# EasyEDA Pro project ProPrj_HydromatMK1_2025-12-27_13-47-41_2026-04-05.epro, board PCB_HydromatMK1
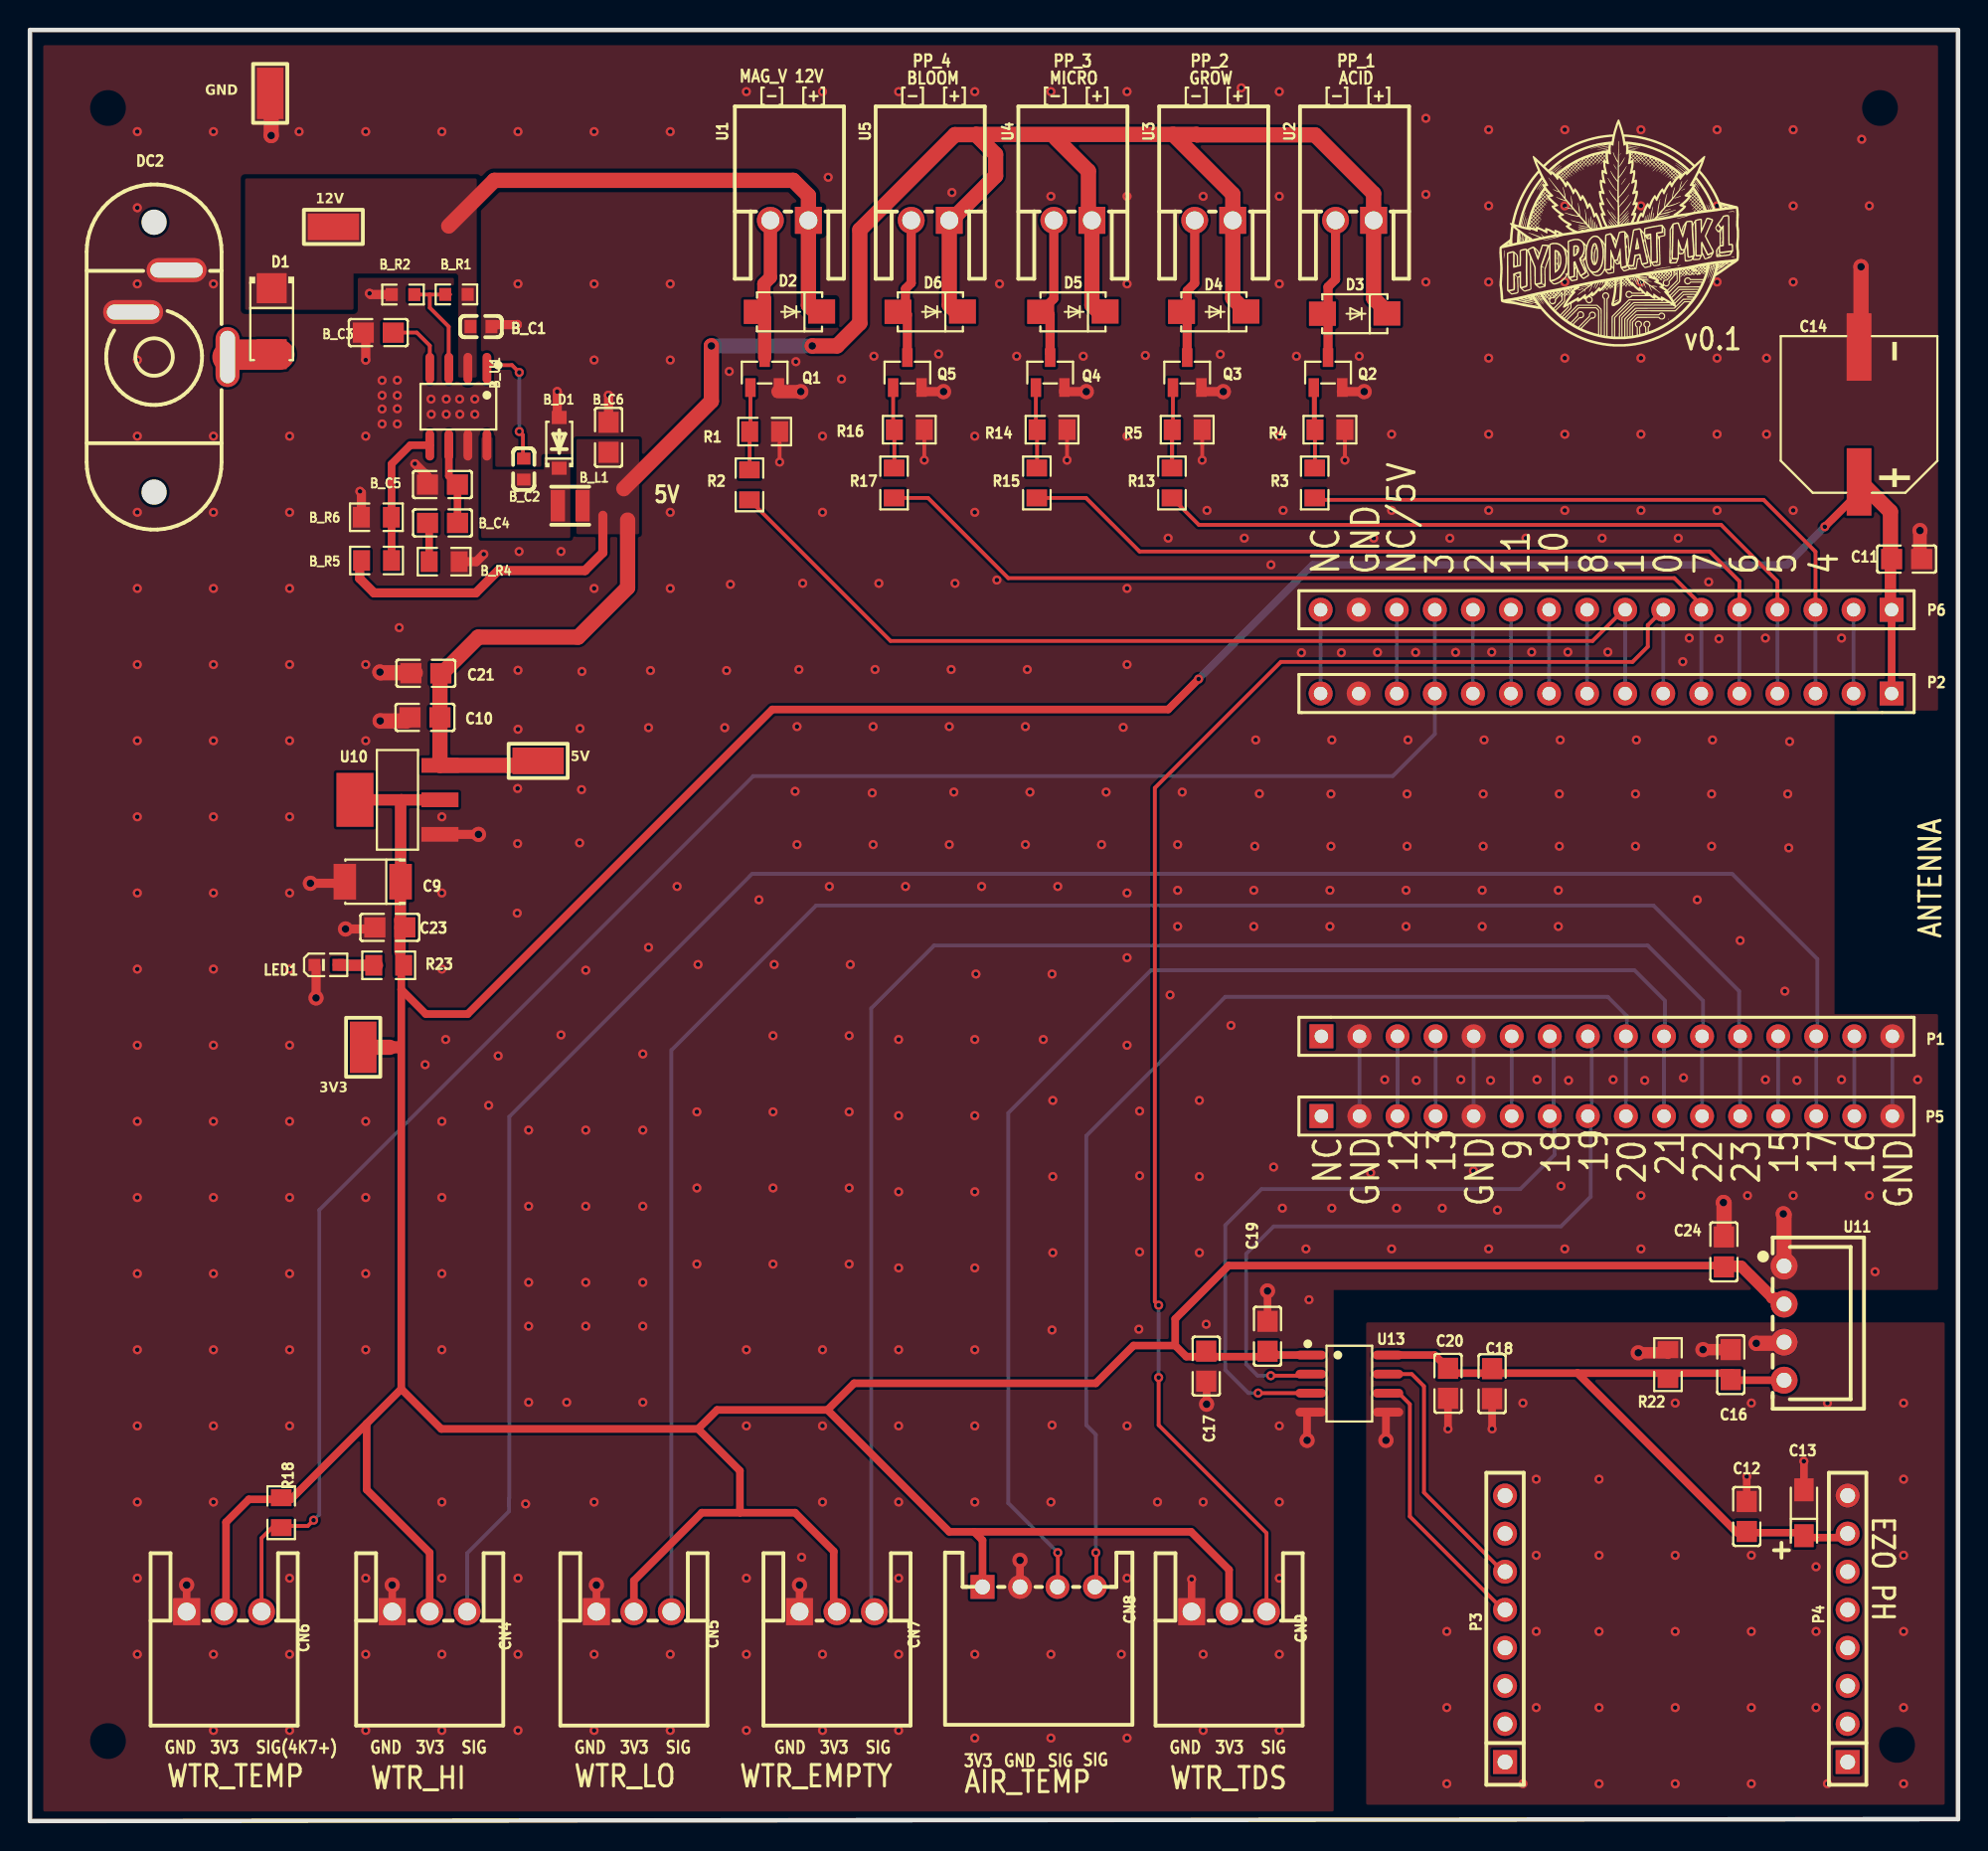
[diagram p1: board, top side]
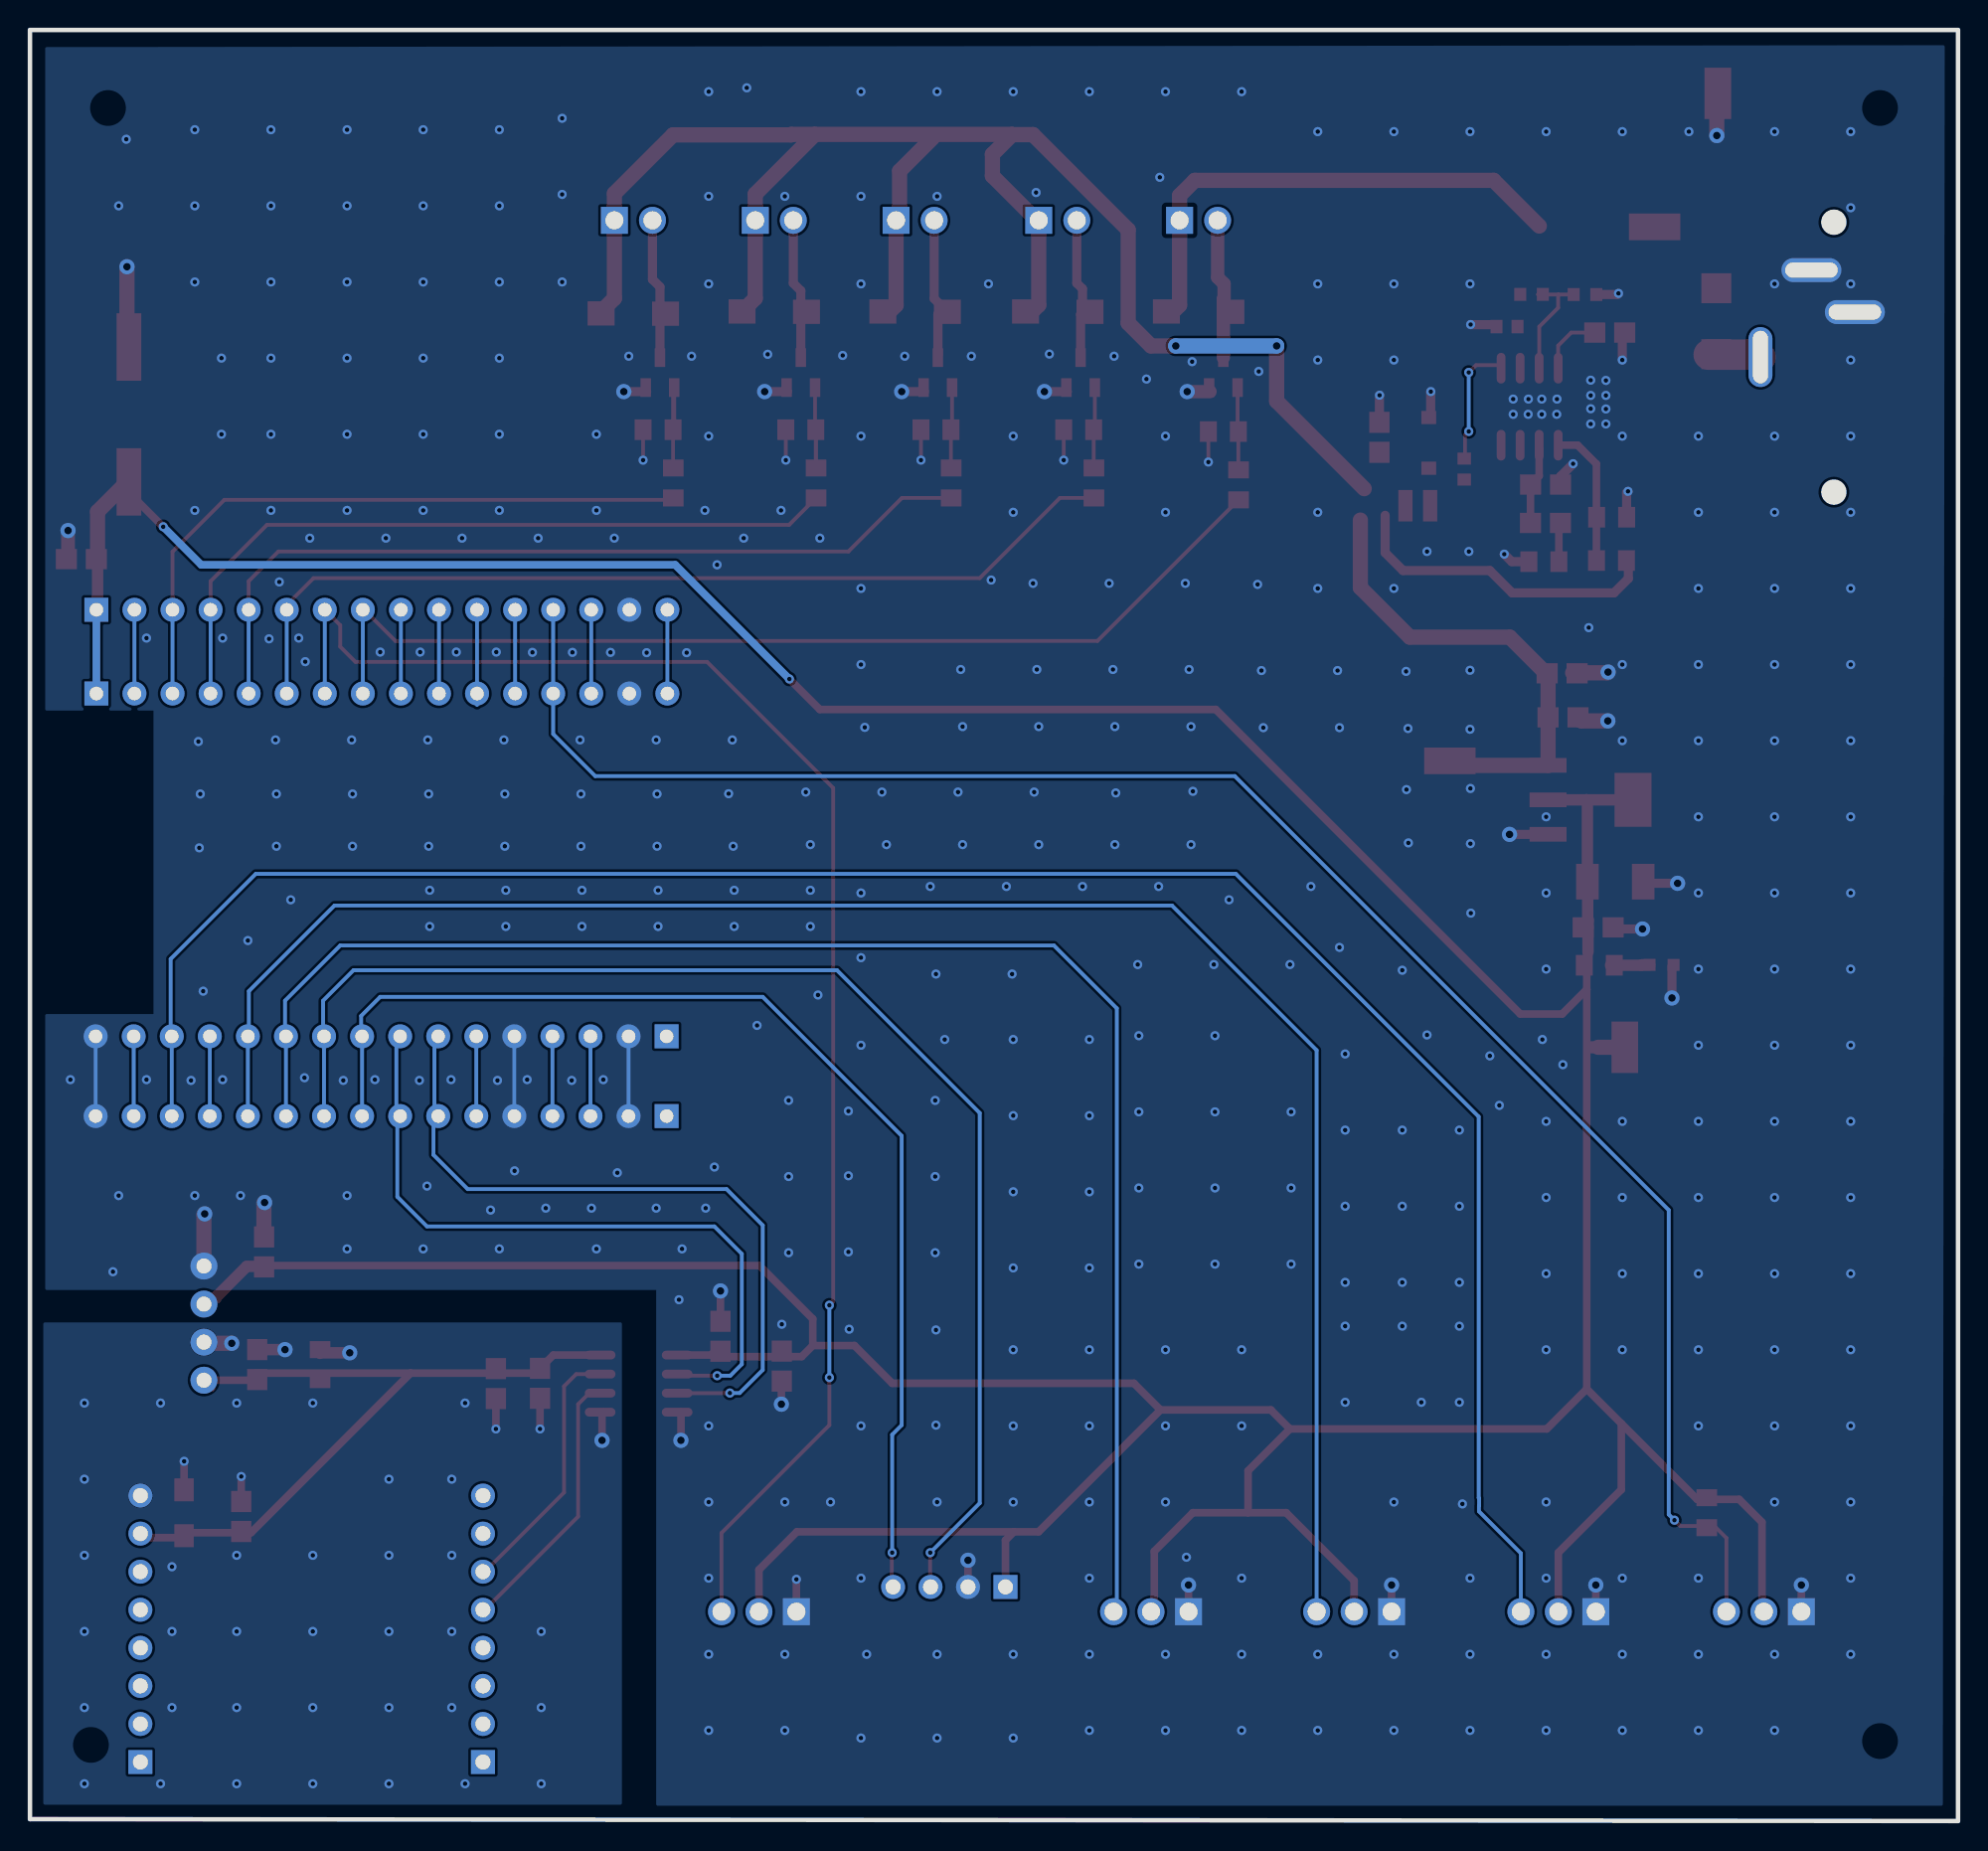
[diagram p2: board, bottom side, seen from below]

Outline 128.65 x 119.51 mm; copper layers: Top Layer, Bottom Layer. Coordinates in mm from the lower left corner of the outline.
Outline path: 0,119.51 0,0 128.65,0.13 128.65,119.51 0,119.51
Stack: Top Layer 0.035mm / Dielectric1 1.51mm FR4 er 4.5 / Bottom Layer 0.035mm

## Design rules (mm)
template: User Custom Config
spacing Default (default): track to track 0.2, other pairs 0 to 0.4
spacing 12V: track to track 0.281, other pairs 0 to 0.281
spacing GND: track to track 0.152, other pairs 0 to 0.175
track width Default (default): min 0.254, default 0.254, max 25.4
track width 12V: min 0.762, default 0.889, max 1.016
track width GND: min 0.254, default 0.254, max 25.4
track width 5V: min 0.127, default 0.61, max 2.54
track width 3V3: min 0.127, default 0.508, max 2.54
differential pair differentialPair (default): width min 0.127, default 0.254, max 2.54; gap min 0.152, default 0.152
via Default (default): diameter min 0.61, default 0.61, max 100.025; hole min 0.305, default 0.305, max 59.995
via 12V: diameter min 1.2, default 1.2, max 100.025; hole min 0.6, default 0.6, max 59.995
via GND: diameter min 0.61, default 0.61, max 100.025; hole min 0.305, default 0.305, max 59.995
net 12V uses 12V
net GND uses GND
net 3V3 uses 3V3
net 5V uses 5V
net 3V3_ISO uses 3V3
net GND_ISO uses GND

## Placement (name value [footprint] x y rotation side)
3V3  5017  [TEST-SMD_L2.7-W1.0]  22.23 51.63 270 top
5V  5017  [TEST-SMD_L2.7-W1.0]  33.91 70.74 0 top
12V  5017  [TEST-SMD_L2.7-W1.0]  20.25 106.37 0 top
B_C1  10uF  [C0603]  30.09 99.72 180 top
B_C2  100nF  [C0603]  32.95 90.21 90 top
B_C3  8.2nF  [C0805]  23.24 99.31 0 top
B_C4  1nF  [C0805]  27.53 86.61 0 top
B_C5  24pF  [C0805]  27.52 89.18 0 top
B_C6  10uF  [C0805]  38.61 92.33 270 top
B_D1  SS24FL  [SOD-123_L2.6-W1.6-LS3.5-RD]  35.32 91.96 90 top
B_L1  6.8uH  [IND-SMD_L2.5-W2.0_FTC252010S]  36.05 87.76 0 top
B_R1  169kΩ  [R0603]  28.46 101.86 0 top
B_R2  39.2kΩ  [R0603]  24.89 101.85 0 top
B_R4  45.3kΩ  [R0805]  27.64 84.03 180 top
B_R5  10.2kΩ  [R0805]  23.12 84.11 180 top
B_R6  10kΩ  [R0805]  23.11 87 0 top
B_U1  TPS54232DR  [SOIC-8_L4.9-W3.9-P1.27-LS6.0-BL]  28.58 94.37 180 top
C9  22uF  [CASE-B_3528]  22.87 62.68 180 top
C10  10uF  [C0805]  26.36 73.64 0 top
C11  100nF  [C0805]  125.22 84.2 180 top
C12  100nF  [C0805]  114.55 20.32 270 top
C13  10uF  [CAP-SMD_L3.2-W1.6-RD-C7171]  118.37 20.57 90 top
C14  470uF  [CAP-SMD_BD10.0-L10.3-W10.3-LS11.0-FD]  122.05 93.85 90 top
C16  10uF  [C0805]  113.49 30.45 270 top
C17  100nF  [C0805]  78.49 30.35 90 top
C18  100nF  [C0805]  97.56 29.19 90 top
C19  10uF  [C0805]  82.58 32.34 270 top
C20  10uF  [C0805]  94.62 29.21 90 top
C21  100nF  [C0805]  26.42 76.58 0 top
C23  100nF  [C0805]  24.01 59.63 0 top
C24  10uF  [C0805]  113.03 37.97 90 top
CN4  S3B-XH-A-1(LF)(SN)  [CONN-TH_S3B-XH-A-1-LF-SN]  26.67 13.97 180 top
CN5  S3B-XH-A-1(LF)(SN)  [CONN-TH_S3B-XH-A-1-LF-SN]  40.3 13.97 180 top
CN6  S3B-XH-A-1(LF)(SN)  [CONN-TH_S3B-XH-A-1-LF-SN]  12.95 13.97 180 top
CN7  S3B-XH-A-1(LF)(SN)  [CONN-TH_S3B-XH-A-1-LF-SN]  53.85 13.97 180 top
CN8  S4B-XH-A(LF)(SN)  [CONN-TH_S4B-XH-A-LF-SN]  67.31 15.62 180 top
CN9  S3B-XH-A-1(LF)(SN)  [CONN-TH_S3B-XH-A-1-LF-SN]  80.01 13.97 180 top
D1  SS54  [SMA_L4.3-W2.6-LS5.1-RD]  16.13 100.08 270 top
D2  SS24  [SMA_L4.3-W2.6-LS5.0-FD]  50.67 100.71 0 top
D3  SS24  [SMA_L4.3-W2.6-LS5.0-FD]  88.39 100.58 0 top
D4  SS24  [SMA_L4.3-W2.6-LS5.0-FD]  78.99 100.71 0 top
D5  SS24  [SMA_L4.3-W2.6-LS5.0-FD]  69.59 100.71 0 top
D6  SS24  [SMA_L4.3-W2.6-LS5.0-FD]  60.07 100.71 0 top
DC2  DC-018-2.5A-2.5  [DC-IN-TH_DC-018]  10.03 100.58 180 top
GND  5017  [TEST-SMD_L2.7-W1.0]  16.03 115.28 270 top
LED1  XL-1608UGC-04  [LED0603-RD_GREEN]  19.78 57.12 0 top
P1  ZX-PM2.54-1-16PY  [HDR-TH_16P-P2.54-V-F-1]  105.22 52.36 0 top
P2  ZX-PM2.54-1-16PY  [HDR-TH_16P-P2.54-V-F-1]  105.17 75.23 180 top
P3  2.54-1*8P母环保  [HDR-TH_8P-P2.54-V-F_2]  98.43 12.83 90 top
P4  2.54-1*8P母环保  [HDR-TH_8P-P2.54-V-F_2]  121.28 12.83 90 top
P5  ZX-PM2.54-1-16PY  [HDR-TH_16P-P2.54-V-F-1]  105.22 47.04 0 top
P6  ZX-PM2.54-1-16PY  [HDR-TH_16P-P2.54-V-F-1]  105.17 80.82 180 top
Q1  IRLML6244TRPBF  [SOT-23-3_L2.9-W1.3-P1.90-LS2.4-BR]  49.02 96.65 270 top
Q2  IRLML6244TRPBF  [SOT-23-3_L2.9-W1.3-P1.90-LS2.4-BR]  86.61 96.65 270 top
Q3  IRLML6244TRPBF  [SOT-23-3_L2.9-W1.3-P1.90-LS2.4-BR]  77.22 96.65 270 top
Q4  IRLML6244TRPBF  [SOT-23-3_L2.9-W1.3-P1.90-LS2.4-BR]  68.07 96.65 270 top
Q5  IRLML6244TRPBF  [SOT-23-3_L2.9-W1.3-P1.90-LS2.4-BR]  58.55 96.65 270 top
R1  10kΩ  [R0805]  49.02 92.71 180 top
R2  100Ω  [R0805]  48.01 89.15 90 top
R3  100Ω  [R0805]  85.72 89.28 270 top
R4  10kΩ  [R0805]  86.74 92.84 180 top
R5  10kΩ  [R0805]  77.22 92.84 180 top
R13  100Ω  [R0805]  76.2 89.28 270 top
R14  10kΩ  [R0805]  68.2 92.84 180 top
R15  100Ω  [R0805]  67.18 89.28 270 top
R16  10kΩ  [R0805]  58.67 92.84 180 top
R17  100Ω  [R0805]  57.66 89.28 90 top
R18  4.7kΩ  [R0805]  16.76 20.57 270 top
R22  100Ω  [R0805]  109.3 30.45 270 top
R23  1kΩ  [R0805]  23.94 57.1 0 top
U1  S2B-XH-A-1(LF)(SN)  [CONN-TH_S2B-XH-A-1-LF-SN]  50.67 106.81 0 top
U2  S2B-XH-A-1(LF)(SN)  [CONN-TH_S2B-XH-A-1-LF-SN]  88.38 106.81 0 top
U3  S2B-XH-A-1(LF)(SN)  [CONN-TH_S2B-XH-A-1-LF-SN]  78.99 106.81 0 top
U4  S2B-XH-A-1(LF)(SN)  [CONN-TH_S2B-XH-A-1-LF-SN]  69.59 106.81 0 top
U5  S2B-XH-A-1(LF)(SN)  [CONN-TH_S2B-XH-A-1-LF-SN]  60.07 106.81 0 top
U10  AMS1117-3.3  [SOT-223-4_L6.5-W3.5-P2.30-LS7.0-BR]  24.52 68.14 0 top
U11  220kHz  [PWRM-TH_B0303S-1WR3]  117.04 33.22 270 top
U13  ADUM1201ARZ-RL7  [SOIC-8_L4.9-W3.9-P1.27-LS6.0-BL]  88.04 29.19 270 top

## Footprints (pads in the part's own frame, mm; a bottom-side part is the same pattern mirrored in y, then rotated)
C0603
  rect 0.8x0.9 smd: 1(-0.7,0) 2(0.7,0)
C0805
  rect 1.41x1.35 smd: 1(-1,0) 2(1,0)
CAP-SMD_BD10.0-L10.3-W10.3-LS11.0-FD
  rect 4.5x1.65 smd: 1(-4.5,0) 2(4.5,0)
CAP-SMD_L3.2-W1.6-RD-C7171
  rect 1.53x1.296 smd: 1(-1.53,0) 2(1.53,0)
CASE-B_3528
  rect 1.506x2.376 smd: 1(-1.861,0) 2(1.861,0)
CONN-TH_S2B-XH-A-1-LF-SN
  rect 1.8x1.8 hole 1.2: 1(1.27,0)
  round 1.8 hole 1.2: 2(-1.27,0)
CONN-TH_S3B-XH-A-1-LF-SN
  rect 1.8x1.8 hole 1.2: 1(2.5,0)
  round 1.8 hole 1.2: 2(0,0) 3(-2.5,0)
CONN-TH_S4B-XH-A-LF-SN
  rect 1.6x1.6 hole 1: 1(3.75,0)
  round 1.6 hole 1: 2(1.25,0) 3(-1.25,0) 4(-3.75,0)
DC-IN-TH_DC-018
  oval 1.6x4 hole 1x3.5: 1(-3.15,2.9)
  oval 4x1.6 hole 3.5x1: 2(0.25,-2.9) 3(3.15,-0.1)
HDR-TH_8P-P2.54-V-F_2
  rect 1.6x1.6 hole 1: 1(-8.89,0)
  round 1.6 hole 1: 2(-6.35,0) 3(-3.81,0) 4(-1.27,0) 5(1.27,0) 6(3.81,0) 7(6.35,0) 8(8.89,0)
HDR-TH_16P-P2.54-V-F-1
  rect 1.6x1.6 hole 0.9: 1(-19.05,0)
  round 1.6 hole 0.9: 2(-16.51,0) 3(-13.97,0) 4(-11.43,0) 5(-8.89,0) 6(-6.35,0) 7(-3.81,0) 8(-1.27,0) 9(1.27,0) 10(3.81,0) 11(6.35,0) 12(8.89,0) 13(11.43,0) 14(13.97,0) 15(16.51,0) 16(19.05,0)
IND-SMD_L2.5-W2.0_FTC252010S
  rect 0.95x2.1 smd: 1(-0.825,0) 2(0.825,0)
LED0603-RD_GREEN
  rect 0.8x0.8 smd: 1(-0.799,-0.004) 2(0.799,0.004)
PWRM-TH_B0303S-1WR3
  round 1.8 hole 1: 1(-3.81,0) 2(-1.27,0) 3(1.27,0) 4(3.81,0)
R0603
  rect 0.806x0.864 smd: 1(-0.753,0) 2(0.753,0)
R0805
  rect 1.133x1.377 smd: 1(-1,0) 2(1,0)
SMA_L4.3-W2.6-LS5.0-FD
  rect 1.8x1.62 smd: 1(2.15,0.009) 2(-2.15,-0.009)
SMA_L4.3-W2.6-LS5.1-RD
  rect 2x2 smd: 1(-2.2,0) 2(2.2,0)
SOD-123_L2.6-W1.6-LS3.5-RD
  rect 0.88x0.99 smd: 1(-1.692,0) 2(1.692,0)
SOIC-8_L4.9-W3.9-P1.27-LS6.0-BL
  oval 0.588x2.045 smd: 1(-1.905,-2.57) 2(-0.635,-2.57) 3(0.635,-2.57) 4(1.905,-2.57) 5(1.905,2.57) 6(0.635,2.57) 7(-0.635,2.57) 8(-1.905,2.57)
SOT-23-3_L2.9-W1.3-P1.90-LS2.4-BR
  rect 1.25x0.7 smd: 1(1,-0.95) 2(1,0.95) 3(-1,0)
SOT-223-4_L6.5-W3.5-P2.30-LS7.0-BR
  rect 2.47x0.98 smd: 1(2.835,-2.3) 2(2.835,0) 3(2.835,2.3)
  rect 2.47x3.6 smd: 4(-2.835,0)
TEST-SMD_L2.7-W1.0
  rect 3.43x1.78 smd: 1(0,0)

## Nets
As in the schematic.

Pads without a net: P1 1; P2 14 16; P3 1 2 3 4 7 8; P4 1 2 3 4 5 6; P5 1; P6 14 16

## Via types
v1: diameter 0.61, hole 0.305, Top Layer to Bottom Layer, 503 vias
v2: diameter 1.016, hole 0.508, Top Layer to Bottom Layer, 30 vias

## Routing (per net, layer and track width the routed paths; a pad name or vN(x,y) marks a point on that pad's centre or on a via; arc(x,y) is an arc through that point)
3V3: length 393
  Top Layer w0.475: 24.77,57.39 24.69,57.48
  Top Layer w0.508: v1(119.76,86.36) 122.05,88.65 122.05,89.46 ; 47.37,20.57 47.37,23.37 44.58,26.16 ; 47.37,20.57 51.05,20.57 53.63,18 53.63,13.97 ; 47.37,20.57 44.83,20.57 40.3,16.04 CN5.2 ; 24.77,28.83 27.44,26.16 44.58,26.16 ; 24.77,28.83 24.77,55.49 ; 24.77,28.83 22.47,26.52 ; 22.47,26.52 22.47,22.11 26.67,17.91 CN4.2 ; 22.47,26.52 17.41,21.46 14.61,21.46 13.08,19.94 13.08,14.1 CN6.2 ; 44.58,26.16 45.85,27.43 53.21,27.43 ; 76.42,31.73 73.64,31.73 71.12,29.21 54.99,29.21 53.21,27.43 ; 76.42,31.73 77.16,30.99 82.6,30.99 82.96,31.34 83.21,31.09 85.21,31.09 ; 76.42,31.73 76.42,33.5 79.97,37.06 112.99,37.06 113.04,37.01 ; 53.21,27.43 61.35,19.3 63,19.3 ; v1(77.98,76.2) 75.95,74.17 49.53,74.17 29.21,53.85 26.41,53.85 24.77,55.49 ; 24.77,55.49 24.77,57.9 24.69,57.99 24.69,57.48 ; 24.71,62.66 C9.1 ; 24.69,59.61 24.71,59.63 ; 63,19.3 77.47,19.3 80.01,16.76 CN9.2 ; 63,19.3 63.56,18.74 63.56,15.78 ; 124.22,75.61 124.22,80.69
  Top Layer w0.762: 116.51,34.9 116.92,34.49 U11.2 ; 124.14,84.2 124.14,81.03 124.22,80.95 ; 24.69,57.99 24.69,60.11 24.71,60.14 24.71,62.91 24.73,62.93 24.73,68.08 24.78,68.14 ; 116.23,34.9 116.23,34.96 114.18,37.01 113.04,37.01 ; 24.78,68.14 U10.2 ; 24.78,68.14 U10.4
  Top Layer w0.813: 24,51.63 24.51,51.63
  Top Layer w1.016: 3V3.1 24,51.63 ; 122.05,89.46 124.14,87.36 124.14,84.2
  Bottom Layer w0.508: v1(119.76,86.36) 117.22,83.82 85.6,83.82 v1(77.98,76.2) ; P2.1 P6.1
3V3_ISO: length 50.8
  Top Layer w0.508: 90.35,31.09 93.73,31.09 C20.2 94.94,29.89 103.25,29.89 ; 103.25,29.89 113.9,19.24 118.04,19.24 118.37,18.91 121.02,18.91 P4.7 ; 103.25,29.89 103.25,29.89 ; 103.25,29.89 113.56,29.89 114.04,29.41 U11.4 116.54,28.91
5V: length 169.7
  Top Layer w0.61: 22,84.11 22,82.91 22.95,81.95 29.75,81.95 31.24,83.44 37.03,83.44 38.23,84.63 38.23,87.12
  Top Layer w1.016: v2(52.2,98.42) 53.85,98.42 55.37,99.95 55.37,106.17 61.72,112.52 63.12,112.52 ; 34.04,70.99 33.48,70.44 U10.3 C10.2 27.36,76.44 29.91,78.99 36.58,78.99 39.88,82.3 39.88,86.8 ; D4.1 80.26,101.6 80.26,108.55 76.27,112.54 ; 63.12,112.52 63.14,112.54 76.27,112.54 ; 63.12,112.52 64.43,111.21 64.43,109.77 61.34,106.68 61.34,101.15 61.77,100.72 ; v2(45.47,98.42) 45.47,94.74 39.62,88.9 ; 76.27,112.54 77.84,112.54 77.88,112.51 85.74,112.51 89.65,108.59 89.65,101.6 90.53,100.72 ; 68.43,112.29 70.62,110.1 70.62,106.92 70.86,106.69 70.86,101.14 71.29,100.71
  Bottom Layer w1.016: v2(45.47,98.42) v2(52.2,98.42)
12V: length 33.6
  Top Layer w1.016: 52.37,100.71 51.94,101.14 U1.1 51.94,108.46 50.93,109.47 30.99,109.47 27.94,106.43
GND: length 93.1
  Top Layer w0.254: R5.1 v1(78.22,90.81) ; R14.1 v1(69.2,90.81) ; R4.1 v1(87.74,90.81) ; R16.1 v1(59.67,90.81) ; R1.1 v1(50.02,90.68)
  Top Layer w0.508: CN9.1 v1(77.51,16.13) ; 85.21,27.28 85.21,25.4 v2(85.22,25.4) ; CN6.1 v2(10.45,15.75) ; C19.1 v2(82.58,35.37) ; CN5.1 v2(37.8,15.75) ; 78.51,29.63 v2(78.51,27.81) ; CN4.1 v2(24.17,15.75) ; CN8.2 v2(66.06,17.4) ; CN7.1 v2(51.35,15.75)
  Top Layer w0.61: 30.79,99.84 32.51,99.84 v1(32.52,99.85) ; v1(22.4,97.48) 22.4,99.15 B_C3.1 ; 20.95,62.68 20.85,62.57 v2(18.71,62.57) ; B_R4.1 29.78,84.03 v1(30.28,84.53) ; v1(38.6,95.13) 38.61,95.12 38.61,93.41 ; 35.19,93.65 35.19,95.37 v1(35.18,95.38) ; B_R2.1 22.73,101.85 v1(22.66,101.93) ; 87.5,95.38 v2(89.03,95.38) ; v1(25.68,90.56) 26.52,89.72 B_C5.1 ; B_R6.1 22.11,88.63 v1(22.02,88.72) ; 19.09,57.05 v2(19.09,54.92) ; 23.3,59.63 23.19,59.52 v2(21.05,59.52) ; 27.79,65.83 v2(29.93,65.83) ; 59.44,95.38 v2(60.96,95.38) ; 78.1,95.38 v2(79.63,95.38) ; 68.96,95.38 v2(70.49,95.38)
  Top Layer w0.889: 49.91,95.38 v2(51.44,95.38)
  Top Layer w0.914: 126.11,84.52 v2(126.11,86.11)
  Top Layer w1.016: 122.18,98.63 v2(122.18,103.71) ; C10.1 25.12,73.41 v2(23.37,73.41) ; v2(16.1,112.46) 16.1,115.21 GND.1 ; 25.71,76.61 23.4,76.61 v2(23.35,76.66) ; U11.1 117.04,40.46 v2(116.99,40.51) ; 113.04,39.01 113.04,41.23 v2(113,41.27)
  Bottom Layer w0.254: 96.33,47.17 96.33,52.49 ; 88.71,52.49 88.71,47.17 ; 124.27,47.17 124.27,52.49
  vias: v1(7.16,112.72) v1(7.16,107.65) v1(7.16,102.56) v1(7.16,97.48) v1(7.16,92.41) v1(7.16,87.33) v1(7.16,82.25) v1(7.16,77.17) v1(7.16,72.08) v1(7.16,67) v1(7.16,61.92) v1(7.16,56.84) v1(7.16,51.77) v1(7.16,46.69) v1(7.16,41.61) v1(7.16,36.53) v1(7.16,31.44) v1(7.16,26.37) v1(7.16,21.28) v1(7.16,16.21) v1(7.16,11.12) v1(12.24,112.72) v1(12.24,102.56) v1(12.24,92.41) v1(12.24,87.33) v1(12.24,82.25) v1(12.24,77.17) v1(12.24,72.08) v1(12.24,67) v1(12.24,61.92) v1(12.24,56.84) v1(12.24,51.77) v1(12.24,46.69) v1(12.24,41.61) v1(12.24,36.53) v1(12.24,31.44) v1(12.24,26.37) v1(12.24,21.28) v1(12.24,11.12) v1(12.24,6.04) v1(17.32,92.41) v1(17.32,87.33) v1(17.32,82.25) v1(17.32,77.17) v1(17.32,72.08) v1(17.32,67) v1(17.32,61.92) v1(17.32,56.84) v1(17.32,51.77) v1(17.32,46.69) v1(17.32,41.61) v1(17.32,36.53) v1(17.32,31.44) v1(17.32,26.37) v1(17.32,16.21) v1(17.32,11.12) v1(17.32,6.04) v1(17.96,112.72) v1(22.4,112.72) v1(22.4,92.41) v1(22.4,77.17) v1(22.4,72.08) v1(22.4,46.69) v1(22.4,41.61) v1(22.4,36.53) v1(22.4,31.44) v1(22.4,16.21) v1(22.4,11.12) v1(22.4,6.04) v1(23.5,96.12) v1(23.5,95.12) v1(23.5,94.22) v1(23.5,93.22) v1(24.51,96.14) v1(24.51,95.12) v1(24.51,94.23) v1(24.51,93.22) v1(24.64,79.63) v1(26.37,50.47) v1(26.76,94.88) v1(26.78,93.86) v1(27.48,112.72) v1(27.48,67) v1(27.48,61.92) v1(27.48,56.84) v1(27.48,46.69) v1(27.48,41.61) v1(27.48,36.53) v1(27.48,31.44) v1(27.48,21.28) v1(27.48,16.21) v1(27.48,11.12) v1(27.48,6.04) v1(27.74,52.15) v1(27.78,94.88) v1(27.78,93.86) v1(28.67,94.88) v1(28.68,93.86) v1(29.68,94.88) v1(29.68,93.86) v1(30.61,47.75) v1(31.24,51.05) v1(32.54,68.9) v1(32.54,65.21) v1(32.51,60.58) v1(32.56,112.72) v1(32.56,102.56) v1(32.64,84.71) v1(32.56,76.78) v1(32.56,72.85) v1(32.56,16.21) v1(32.56,11.12) v1(32.56,6.04) v1(33.07,21.16) v1(33.27,46.1) v1(33.27,41.02) v1(33.27,35.94) v1(33.27,33.02) v1(33.27,27.94) v1(35.43,84.71) v1(35.43,52.45) v1(35.81,27.94) v1(36.7,72.9) v1(36.68,65.27) v1(36.83,76.71) v1(36.8,68.82) v1(37.08,56.77) v1(37.08,46.1) v1(37.08,41.02) v1(37.08,35.94) v1(37.08,33.02) v1(37.64,112.72) v1(37.64,102.56) v1(37.64,97.48) v1(37.64,82.25) v1(37.64,21.28) v1(37.64,11.12) v1(37.64,6.04) v1(40.89,51.18) v1(40.89,46.1) v1(40.89,41.02) v1(40.89,35.94) v1(40.89,33.02) v1(40.89,27.94) v1(41.28,72.95) v1(41.28,58.29) v1(41.4,76.76) v1(42.72,112.72) v1(42.72,102.56) v1(42.72,97.48) v1(42.72,87.33) v1(42.72,82.25) v1(42.72,11.12) v1(42.72,6.04) v1(43.18,62.36) v1(44.5,47.32) v1(44.5,42.24) v1(44.5,37.16) v1(44.58,57.15) v1(46.36,72.95) v1(46.48,76.76) v1(46.66,96.72) v1(46.74,82.51) v1(47.8,115.39) v1(47.8,31.44) v1(47.8,26.37) v1(47.8,16.21) v1(47.8,11.12) v1(47.8,6.04) v1(48.64,61.47) v1(49.58,52.4) v1(49.58,47.32) v1(49.58,42.24) v1(49.58,37.16) v1(49.66,57.15) v1(51.1,97.38) v1(51.05,68.71) v1(51.18,73.03) v1(51.18,65.15) v1(51.31,76.83) v1(51.49,17.6) v1(51.56,82.59) v1(52.88,115.39) v1(52.88,92.41) v1(52.88,87.33) v1(52.88,31.44) v1(52.88,26.37) v1(52.88,21.28) v1(52.88,11.12) v1(52.88,6.04) v1(53.26,109.68) v1(53.34,62.36) v1(54.15,96.22) v1(54.74,57.15) v1(54.66,52.4) v1(54.66,47.32) v1(54.66,42.24) v1(54.66,37.16) v1(56.2,68.6) v1(56.31,97.74) v1(56.26,73.03) v1(56.26,65.15) v1(56.39,76.83) v1(56.64,82.59) v1(57.96,115.39) v1(57.96,52.15) v1(57.96,47.07) v1(57.96,41.99) v1(57.96,36.91) v1(57.96,31.44) v1(57.96,26.37) v1(57.96,21.28) v1(57.96,16.21) v1(57.96,11.12) v1(57.96,6.04) v1(58.42,62.36) v1(60.63,97.88) v1(61.34,73.03) v1(61.34,65.15) v1(61.52,108.66) v1(61.47,76.83) v1(61.65,68.66) v1(61.72,82.59) v1(63.04,115.39) v1(63.04,92.41) v1(63.04,87.33) v1(63.04,52.15) v1(63.04,47.07) v1(63.04,41.99) v1(63.04,36.91) v1(63.04,31.44) v1(63.04,26.37) v1(63.04,21.28) v1(63.04,11.12) v1(63.04,5.54) v1(63.12,56.52) v1(63.5,62.36) v1(64.52,82.8) v1(64.69,102.56) v1(65.84,97.74) v1(66.42,73.03) v1(66.42,65.15) v1(66.55,76.83) v1(66.73,68.66) v1(67.62,52.15) v1(68.12,115.39) v1(68.12,108.41) v1(68.12,21.28) v1(68.12,11.12) v1(68.12,5.54) v1(68.2,56.52) v1(68.25,48.08) v1(68.25,43) v1(68.25,37.92) v1(68.2,32.77) v1(68.2,26.42) v1(68.58,62.36) v1(70.28,97.74) v1(71.5,65.15) v1(71.81,68.66) v1(72.82,11.12) v1(72.95,72.97) v1(73.2,115.39) v1(73.2,108.41) v1(73.2,102.56) v1(73.2,92.41) v1(73.2,82.25) v1(73.2,77.17) v1(73.2,61.92) v1(73.2,57.61) v1(73.2,51.77) v1(73.2,26.37) v1(73.2,16.21) v1(73.2,5.54) v1(74.04,47.37) v1(74.04,43.05) v1(74.04,37.97) v1(73.99,32.82) v1(74.42,97.79) v1(75.24,21.28) v1(75.95,85.6) v1(76.07,55.12) v1(76.58,65.15) v1(76.58,62.1) v1(76.58,59.69) v1(76.89,68.66) v1(78.03,48.08) v1(78.03,43) v1(78.03,37.92) v1(78.28,108.41) v1(78.28,21.28) v1(78.28,11.12) v1(78.28,6.04) v1(78.54,87.45) v1(78.49,33.15) v1(79.43,97.87) v1(80.14,53.09) v1(80.82,115.65) v1(81.03,85.6) v1(81.73,65.04) v1(81.66,62.1) v1(81.66,59.69) v1(81.79,72.14) v1(82.03,68.55) v1(82.8,83.82) v1(82.98,43.64) v1(83.36,115.39) v1(83.36,108.41) v1(83.36,102.56) v1(83.36,92.41) v1(83.36,26.37) v1(83.36,21.28) v1(83.36,16.21) v1(83.36,11.12) v1(83.36,6.04) v1(83.62,87.45) v1(83.57,40.89) v1(84.51,97.74) v1(84.84,77.96) v1(85.14,38.18) v1(85.34,34.78) v1(86.74,62.1) v1(86.74,59.69) v1(86.81,68.53) v1(86.81,65.04) v1(86.87,72.14) v1(86.87,40.89) v1(87.5,77.96) v1(88.7,97.74) v1(89.46,43.26) v1(89.66,85.6) v1(89.92,77.98) v1(90.4,49.47) v1(90.86,92.53) v1(90.86,87.45) v1(90.86,38.18) v1(91.19,40.89) v1(91.82,62.1) v1(91.82,59.69) v1(91.95,72.14) v1(91.89,68.53) v1(91.89,65.04) v1(92.46,77.98) v1(92.5,49.42) v1(93.14,113.61) v1(93.14,108.53) v1(93.14,102.69) v1(94.23,40.89) v1(94.74,85.6) v1(95.12,77.98) v1(95.48,49.47) v1(96.32,43.38) v1(96.9,62.1) v1(96.9,59.69) v1(97.03,72.14) v1(96.97,68.53) v1(96.97,65.04) v1(97.33,112.85) v1(97.33,107.77) v1(97.33,102.69) v1(97.33,97.61) v1(97.33,92.53) v1(97.33,87.45) v1(97.33,38.18) v1(97.54,78) v1(97.46,49.42) v1(97.92,40.77) v1(99.82,85.6) v1(100.2,78) v1(100.56,49.47) v1(102.05,68.53) v1(102.05,65.04) v1(101.98,62.1) v1(101.98,59.69) v1(102.11,72.14) v1(102.16,42.37) v1(102.41,112.85) v1(102.41,107.77) v1(102.41,102.69) v1(102.41,97.61) v1(102.41,92.53) v1(102.41,87.45) v1(102.41,38.18) v1(102.62,78) v1(102.66,49.42) v1(104.9,85.6) v1(105.28,78) v1(105.64,49.47) v1(107.13,68.53) v1(107.13,65.04) v1(107.19,72.14) v1(107.49,112.85) v1(107.49,107.77) v1(107.49,102.69) v1(107.49,97.61) v1(107.49,92.53) v1(107.49,87.45) v1(107.49,41.73) v1(107.49,38.18) v1(107.74,49.42) v1(109.98,85.6) v1(110.28,77.36) v1(110.34,49.59) v1(110.72,78.93) v1(111.25,61.47) v1(112.01,82.68) v1(112.21,68.53) v1(112.21,65.04) v1(112.27,72.14) v1(112.57,112.85) v1(112.57,107.77) v1(112.57,102.69) v1(112.57,97.61) v1(112.57,92.53) v1(112.57,87.45) v1(112.7,78.88) v1(114.11,58.75) v1(114.6,41.73) v1(115.8,78.93) v1(115.8,49.47) v1(115.88,97.61) v1(115.88,92.53) v1(117.09,55.37) v1(117.29,68.53) v1(117.41,72.03) v1(117.35,64.94) v1(117.65,112.85) v1(117.65,107.77) v1(117.65,102.69) v1(117.65,87.45) v1(117.65,41.73) v1(117.9,49.42) v1(120.88,78.93) v1(120.88,49.47) v1(122.22,112.22) v1(122.73,107.77) v1(122.73,41.73) v1(123.11,36.65) v1(125.96,49.47)
GND_ISO: length 15.7
  Top Layer w0.508: v2(90.48,25.4) 90.48,27.15 90.35,27.28 ; v1(118.36,24) 118.37,24 118.37,21.97 ; C12.1 114.55,22.91 ; C20.1 v1(94.62,26.16) ; 97.56,28.49 v1(97.56,26.16)
  Top Layer w0.762: 109.3,31.21 109.26,31.24 v2(107.31,31.24) ; C16.1 v2(111.63,31.45)
  Top Layer w1.016: U11.3 116.97,31.88 v2(115.19,31.88)
  vias: v1(94.54,12.65) v1(94.54,7.57) v1(94.54,2.49) v1(99.62,27.89) v1(99.62,2.49) v1(100.51,22.81) v1(100.51,17.73) v1(100.51,12.65) v1(100.51,7.57) v1(104.7,22.81) v1(104.7,17.73) v1(104.7,12.65) v1(104.7,7.57) v1(104.7,2.49) v1(109.78,27.89) v1(109.78,17.73) v1(109.78,12.65) v1(109.78,7.57) v1(109.78,2.49) v1(114.55,22.99) v1(114.86,27.89) v1(114.86,17.73) v1(114.86,12.65) v1(114.86,7.57) v1(114.86,2.49) v1(119.18,16.97) v1(119.18,12.65) v1(119.18,7.57) v1(119.94,27.89) v1(119.94,2.49) v1(125.02,27.89) v1(125.02,22.81) v1(125.02,17.73) v1(125.02,12.65) v1(125.02,7.57) v1(125.02,2.49)
(no net): length 11.2
  Bottom Layer w0.254: P2.16 P6.16 ; P2.14 P6.14
BOOT: length 8
  Top Layer w0.254: 32.89,91.13 32.89,92.47 v1(32.65,92.72) ; v1(32.65,96.66) 32.16,97.14 30.49,97.14
  Bottom Layer w0.254: v1(32.65,96.66) v1(32.65,92.72)
COMP: length 5.2
  Top Layer w0.508: 27.95,91.6 27.95,89.75 B_C5.2 ; 28.53,89.17 B_C4.2
EN: length 7
  Top Layer w0.254: 28.02,101.86 28.02,101.85 26.68,101.85 ; 26.66,101.86 26.67,101.85 ; 28.07,97.54 27.94,97.67 27.94,99.71 26.68,100.97 26.68,101.85 ; 25.97,101.86 25.98,101.85 26.68,101.85
GPIO0: length 103.5
  Top Layer w0.254: v1(75.31,29.59) 75.31,26.42 82.51,19.22 CN9.3 ; P6.7 107.95,79.79 107.95,78.36 106.93,77.34 83.47,77.34 75.06,68.93 75.06,34.67 v1(75.31,34.42) ; P2.7 108.79,75.23
  Bottom Layer w0.254: P2.7 P6.7 ; v1(75.31,29.59) v1(75.31,34.42)
GPIO1: length 68.8
  Top Layer w0.254: P6.8 106.35,80.82 104.27,78.74 57.42,78.74 R2.1
  Bottom Layer w0.254: P2.8 P6.8
GPIO2: length 5.6
  Bottom Layer w0.254: P2.12 P6.12
GPIO3: length 125.6
  Top Layer w0.254: CN6.3 15.45,18.88 16.26,19.69 18.53,19.69 v1(18.92,20.07)
  Bottom Layer w0.254: P6.13 P2.13 93.74,72.53 90.93,69.72 48.26,69.72 19.3,40.77 19.3,20.46 v1(18.92,20.07)
GPIO4: length 44.2
  Top Layer w0.254: R3.2 85.85,88.15 115.68,88.15 119.14,84.69 119.14,80.95
  Bottom Layer w0.254: P2.3 P6.3
GPIO5: length 50.1
  Top Layer w0.254: R13.2 77.99,86.49 112.84,86.49 116.6,82.73 116.6,80.95
  Bottom Layer w0.254: P2.4 P6.4
GPIO6: length 56.5
  Top Layer w0.254: 114.06,80.95 114.06,82.73 112.08,84.71 74.04,84.71 70.47,88.28 R15.2
  Bottom Layer w0.254: P2.5 P6.5
GPIO7: length 62.6
  Top Layer w0.254: R17.1 59.93,88.28 65.28,82.93 109.73,82.93 111.52,81.14 111.52,80.95
  Bottom Layer w0.254: P2.6 P6.6
GPIO8: length 5.6
  Bottom Layer w0.254: P2.9 P6.9
GPIO9: length 5.3
  Bottom Layer w0.254: 98.87,52.49 98.87,47.17
GPIO10: length 5.6
  Bottom Layer w0.254: P2.10 P6.10
GPIO11: length 6.3
  Bottom Layer w0.254: P6.11 98.82,74.47
GPIO12: length 5.3
  Bottom Layer w0.254: 91.25,47.17 91.25,52.49
GPIO13: length 5.3
  Bottom Layer w0.254: 93.79,52.49 93.79,47.17
GPIO15: length 5.3
  Bottom Layer w0.254: 116.65,52.49 116.65,47.17
GPIO16: length 5.3
  Bottom Layer w0.254: 121.73,52.49 121.73,47.17
GPIO17: length 140.9
  Bottom Layer w0.254: 119.19,47.17 119.19,52.49 119.26,52.56 119.26,57.52 113.59,63.2 48.19,63.2 31.98,47 31.98,21.56 31.96,21.54 31.96,21.03 31.97,21.02 31.97,20.66 29.17,17.87 CN4.3
GPIO18: length 47.8
  Top Layer w0.254: v1(81.95,28.56) 81.96,28.55 85.21,28.55
  Bottom Layer w0.254: v1(81.95,28.56) 81.3,28.56 79.76,30.1 79.76,39.75 82.17,42.16 99.44,42.16 101.73,44.45 101.73,47.1 101.66,47.17 101.66,52.23 101.41,52.49
GPIO18_ISO: length 18.3
  Top Layer w0.254: 98.3,14.1 92.07,20.32 92.07,27.81 91.34,28.55 90.35,28.55
GPIO19: length 47.3
  Top Layer w0.254: v1(82.8,29.71) 85.11,29.71 85.21,29.82
  Bottom Layer w0.254: v1(82.8,29.71) 81.92,29.71 81.15,30.48 81.15,37.85 82.98,39.68 102.16,39.68 104.14,41.66 104.14,47.1 104.2,47.17 104.2,52.23 103.95,52.49
GPIO19_ISO: length 17.6
  Top Layer w0.254: 90.35,29.82 92.2,29.82 93.02,29.01 93.02,21.92 98.3,16.64
GPIO20: length 77.4
  Top Layer w0.254: v1(71.12,17.91) 71.15,17.88 71.15,15.71 CN8.4
  Bottom Layer w0.254: 106.49,47.17 106.49,52.49 106.55,52.55 106.55,53.72 105.28,54.99 79.76,54.99 70.49,45.72 70.49,26.42 71.12,25.78 v1(71.12,17.91)
GPIO21: length 89.2
  Top Layer w0.254: CN8.3 68.59,15.65 68.59,17.9 v1(68.58,17.91)
  Bottom Layer w0.254: 109.03,47.17 109.03,52.49 109.09,52.55 109.09,54.74 107.06,56.77 74.8,56.77 65.28,47.24 65.28,21.21 v1(68.58,17.91)
GPIO22: length 106.6
  Bottom Layer w0.254: 111.57,47.17 111.57,52.49 111.63,52.55 111.63,54.74 107.95,58.42 60.32,58.42 56.13,54.23 56.13,13.97
GPIO23: length 123.3
  Bottom Layer w0.254: CN5.3 42.8,13.97 42.8,51.44 52.45,61.09 108.33,61.09 114.05,55.37 114.05,52.55 114.11,52.49 114.11,47.17
RST: length 5.6
  Bottom Layer w0.254: P2.2 P6.2
SS: length 4.1
  Top Layer w0.254: B_C3.2 25.81,99.31 26.68,98.45 26.68,97.14
VSENSE: length 9.9
  Top Layer w0.508: B_U1.5 25.38,91.8 24.13,90.55 24.13,83.79 24.06,83.73
$1N1: length 3.5
  Top Layer w2.032: DC2.1 13.34,97.84 16.64,97.84
$1N13: length 9.4
  Top Layer w0.254: 49.02,97.65 48.97,97.7
  Top Layer w0.889: 49.02,97.65 49.02,101.55 48.97,101.6 48.97,102.57 49.4,103 U1.2
$1N20: length 9.4
  Top Layer w0.61: U3.2 77.72,102.61 77.22,102.11 77.22,100.78 77.29,100.71 77.22,100.64 Q3.3
$1N24: length 12.7
  Top Layer w0.254: 67.89,100.71 67.89,97.83 Q4.3
  Top Layer w0.61: D5.2 68.32,101.58 U4.2 ; Q4.3 68.07,100.53 67.89,100.71
$1N27: length 5.4
  Top Layer w0.254: 67.2,90.42 67.18,90.41 ; 67.2,90.42 67.2,90.3 R15.1 ; 67.2,90.42 R14.2 67.12,92.91 67.12,95.65
$1N28: length 9.4
  Top Layer w0.61: U5.2 58.8,102.62 58.42,102.23 58.42,100.89 58.37,100.84 58.37,100.71 58.55,100.53 Q5.3
$1N63: length 8.2
  Top Layer w0.254: R4.2 85.74,95.57 85.66,95.65 85.66,92.91 R4.2 ; R4.2 85.74,90.3 R3.1
$1N1609: length 2.6
  Top Layer w0.508: B_C4.1 26.64,86.51 B_R4.2
$1N3439: length 9.4
  Top Layer w0.61: U2.2 87.11,102.86 86.61,102.36 86.61,100.78 86.69,100.71 86.61,100.64 Q2.3
$1N3479: length 7.8
  Top Layer w0.254: 76.2,90.41 76.2,92.82 R5.2 ; R5.2 76.22,90.3 R13.1 ; R5.2 76.27,92.89 76.27,95.65
$1N3487: length 5.4
  Top Layer w0.254: 57.6,95.65 57.6,92.91 R16.2 57.67,90.42 ; 57.67,90.42 57.66,90.41 ; 57.67,90.42 57.67,90.3 R17.2
$1N3521: length 5.7
  Top Layer w0.254: 48.02,90.42 48.01,90.41 ; 48.02,90.42 48.02,90.17 R2.2 ; 48.02,90.42 R1.2 ; 48.07,92.89 48.07,92.76 R1.2 ; 48.07,92.89 Q1.1 ; 48.07,92.89 48.02,92.84 R1.2
$1N9552: length 2.7
  Top Layer w0.254: 23.15,57.13 23.18,57.1
  Top Layer w0.762: LED1.2 21.09,57.13 21.12,57.1 23.18,57.1

## Copper pours and planes (outline as drawn; the poured copper is in the pictures)
5V on Top Layer: 40.65,92.21 40.65,85.86 36.46,85.86 36.46,92.21
12V on Top Layer: 29.81,96.32 29.81,109.6 14.35,109.6 14.35,100.84 21.59,100.84 21.59,103.25 28.45,103.25 28.58,103.12 28.58,96.32
GND on Top Layer: 0.89,118.49 127.32,118.49 127.32,0.63 0.89,0.63
GND on Bottom Layer: 86.87,1.02 1.02,1.02 0.89,118.49 127.63,118.36 127.63,35.43 86.87,35.43
GND_ISO on Top Layer: 127.76,1.09 127.76,33.27 89.15,33.27 89.15,1.09
GND_ISO on Bottom Layer: 127.76,1.09 127.76,33.27 89.15,33.27 89.15,1.09
PH on Top Layer: 36.05,91.03 36.05,85.61 30.11,85.61 30.11,92.34 30.87,92.34 30.87,90.18 34.3,90.18 34.3,91.03

## Text on the board
Top Silkscreen Layer: MAG_V 12V | [-] | [+] | BLOOM | PP_4 | MICRO | PP_3 | GROW | PP_2 | PP_1 | ACID | GND | 3V3 | SIG(4K7+) | SIG | 5V | WTR_TEMP | WTR_HI | WTR_LO | WTR_EMPTY | AIR_TEMP | WTR_TDS | v0.1 | EZO PH | ANTENNA | NC | NC/5V | 12 | 3 | 13 | 2 | 11 | 9 | 10 | 18 | 8 | 19 | 1 | 20 | 0 | 21 | 7 | 22 | 6 | 23 | 5 | 15 | 17 | 4 | 16
